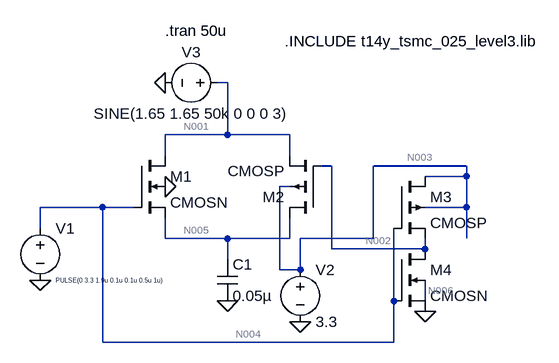
[diagram p0: schematic s_and_h.asc]
s_and_h.asc, the LTspice schematic file:
Version 4
SHEET 1 880 680
WIRE 192 16 176 16
WIRE 192 96 192 16
WIRE 192 96 96 96
WIRE 288 96 192 96
WIRE 96 128 96 96
WIRE 288 128 288 96
WIRE 352 144 336 144
WIRE 560 144 416 144
WIRE 560 160 560 144
WIRE 560 160 496 160
WIRE 288 176 272 176
WIRE 0 208 -96 208
WIRE 48 208 0 208
WIRE 560 208 560 160
WIRE 560 208 496 208
WIRE -96 240 -96 208
WIRE 96 256 96 224
WIRE 192 256 96 256
WIRE 288 256 288 224
WIRE 288 256 192 256
WIRE 416 256 416 144
WIRE 416 256 304 256
WIRE 560 256 560 208
WIRE 352 272 352 144
WIRE 496 272 496 256
WIRE 496 272 352 272
WIRE 192 288 192 256
WIRE 272 304 272 176
WIRE 304 304 304 256
WIRE 304 304 272 304
WIRE 448 352 448 240
WIRE 496 352 496 320
WIRE 0 416 0 208
WIRE 448 416 448 352
WIRE 448 416 0 416
FLAG -96 320 0
FLAG 192 352 0
FLAG 304 384 0
FLAG 496 368 0
FLAG 96 16 0
FLAG 96 176 0
SYMBOL voltage -96 224 R0
WINDOW 3 24 96 Left 0
WINDOW 123 0 0 Left 0
WINDOW 39 0 0 Left 0
SYMATTR Value PULSE(0 3.3 1.9u 0.1u 0.1u 0.5u 1u)
SYMATTR InstName V1
SYMBOL voltage 304 288 R0
WINDOW 123 0 0 Left 0
WINDOW 39 0 0 Left 0
SYMATTR InstName V2
SYMATTR Value 3.3
SYMBOL voltage 192 16 R90
WINDOW 0 -32 56 VBottom 2
WINDOW 3 32 56 VTop 2
WINDOW 123 0 0 Left 0
WINDOW 39 0 0 Left 0
SYMATTR InstName V3
SYMATTR Value SINE(1.65 1.65 50k 0 0 0 3)
SYMBOL cap 176 288 R0
SYMATTR InstName C1
SYMATTR Value 0.05µ
SYMATTR SpiceLine V=4
SYMBOL nmos4 48 128 R0
SYMATTR InstName M1
SYMATTR Value2 l=250n w=10u m=40
SYMATTR Value CMOSN
SYMBOL pmos4 336 224 R180
SYMATTR InstName M2
SYMATTR Value2 l=250n w=20u m=40
SYMATTR Value CMOSP
SYMBOL pmos4 448 160 R0
SYMATTR InstName M3
SYMATTR Value2 l=250n w=20u m=40
SYMATTR Value CMOSP
SYMBOL nmos4 448 272 R0
SYMATTR InstName M4
SYMATTR Value2 l=250n w=10u m=40
SYMATTR Value CMOSN
TEXT 96 -64 Left 2 !.tran 50u
TEXT 280 -48 Left 2 !.INCLUDE t14y_tsmc_025_level3.lib

The netlist it stands for:
* s_and_h.asc
V1 N004 0 PULSE(0 3.3 1.9u 0.1u 0.1u 0.5u 1u)
V2 N003 0 3.3
V3 N001 0 SINE(1.65 1.65 50k 0 0 0 3)
C1 N005 0 0.05µ V=4
M1 N001 N004 N005 0 CMOSN l=250n w=10u m=40
M2 N005 N002 N001 N003 CMOSP l=250n w=20u m=40
M3 N003 N004 N002 N003 CMOSP l=250n w=20u m=40
M4 N002 N004 0 N006 CMOSN l=250n w=10u m=40
.model NMOS NMOS
.model PMOS PMOS
.lib standard.mos
.tran 50u
.INCLUDE t14y_tsmc_025_level3.lib
.backanno
.end

* Results of the author's LTspice run, read from the files saved beside the schematic
* Operating Point, zero values left out:
*   V(n003) = 3.3 V
*   V(n001) = 1.65 V
*   V(n005) = 1.65 V
*   V(n002) = 3.3 V
*   V(n006) = 147.7 mV
*   Id(M3) = 70.55 nA
*   Is(M3) = -70.55 nA
*   Id(M2) = -66.4 pA
*   Ib(M2) = 132.8 pA
*   Is(M2) = -66.4 pA
*   Id(M4) = 70.55 nA
*   Is(M4) = -70.55 nA
*   Id(M1) = 66.4 pA
*   Ib(M1) = -132.8 pA
*   Is(M1) = 66.4 pA
*   I(V2) = -70.69 nA
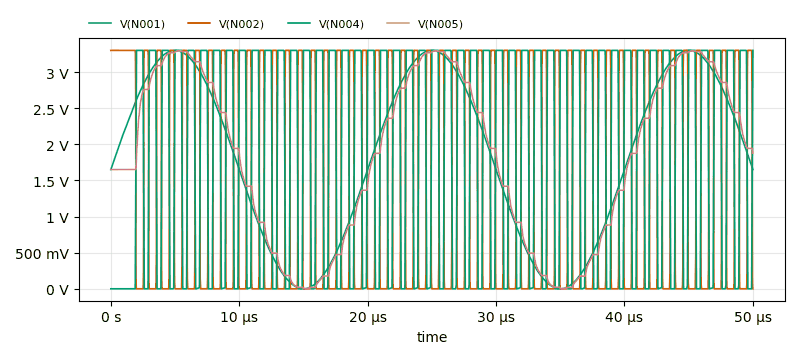
[diagram p1: Transient Analysis of s_and_h.asc, plotted from the saved traces]
* Transient Analysis, 1 run:
*   V(N001): min 0 V, max 3.3 V, average 1.86 V, rms 2.186 V, last 1.65 V
*   V(N002): min -57.43 µV, max 3.3 V, average 1.355 V, rms 2.091 V, last 158.5 µV
*   V(N004): min 0 V, max 3.3 V, average 1.904 V, rms 2.436 V, last 3.3 V
*   V(N005): min 1.865 mV, max 3.294 V, average 1.842 V, rms 2.168 V, last 1.878 V